# Altium schematic sheet EVK-IRIS-W1-TOP SHEET.SchDoc
size A3; DocumentNumber: 1; SheetNumber: 1; SheetTotal: 14
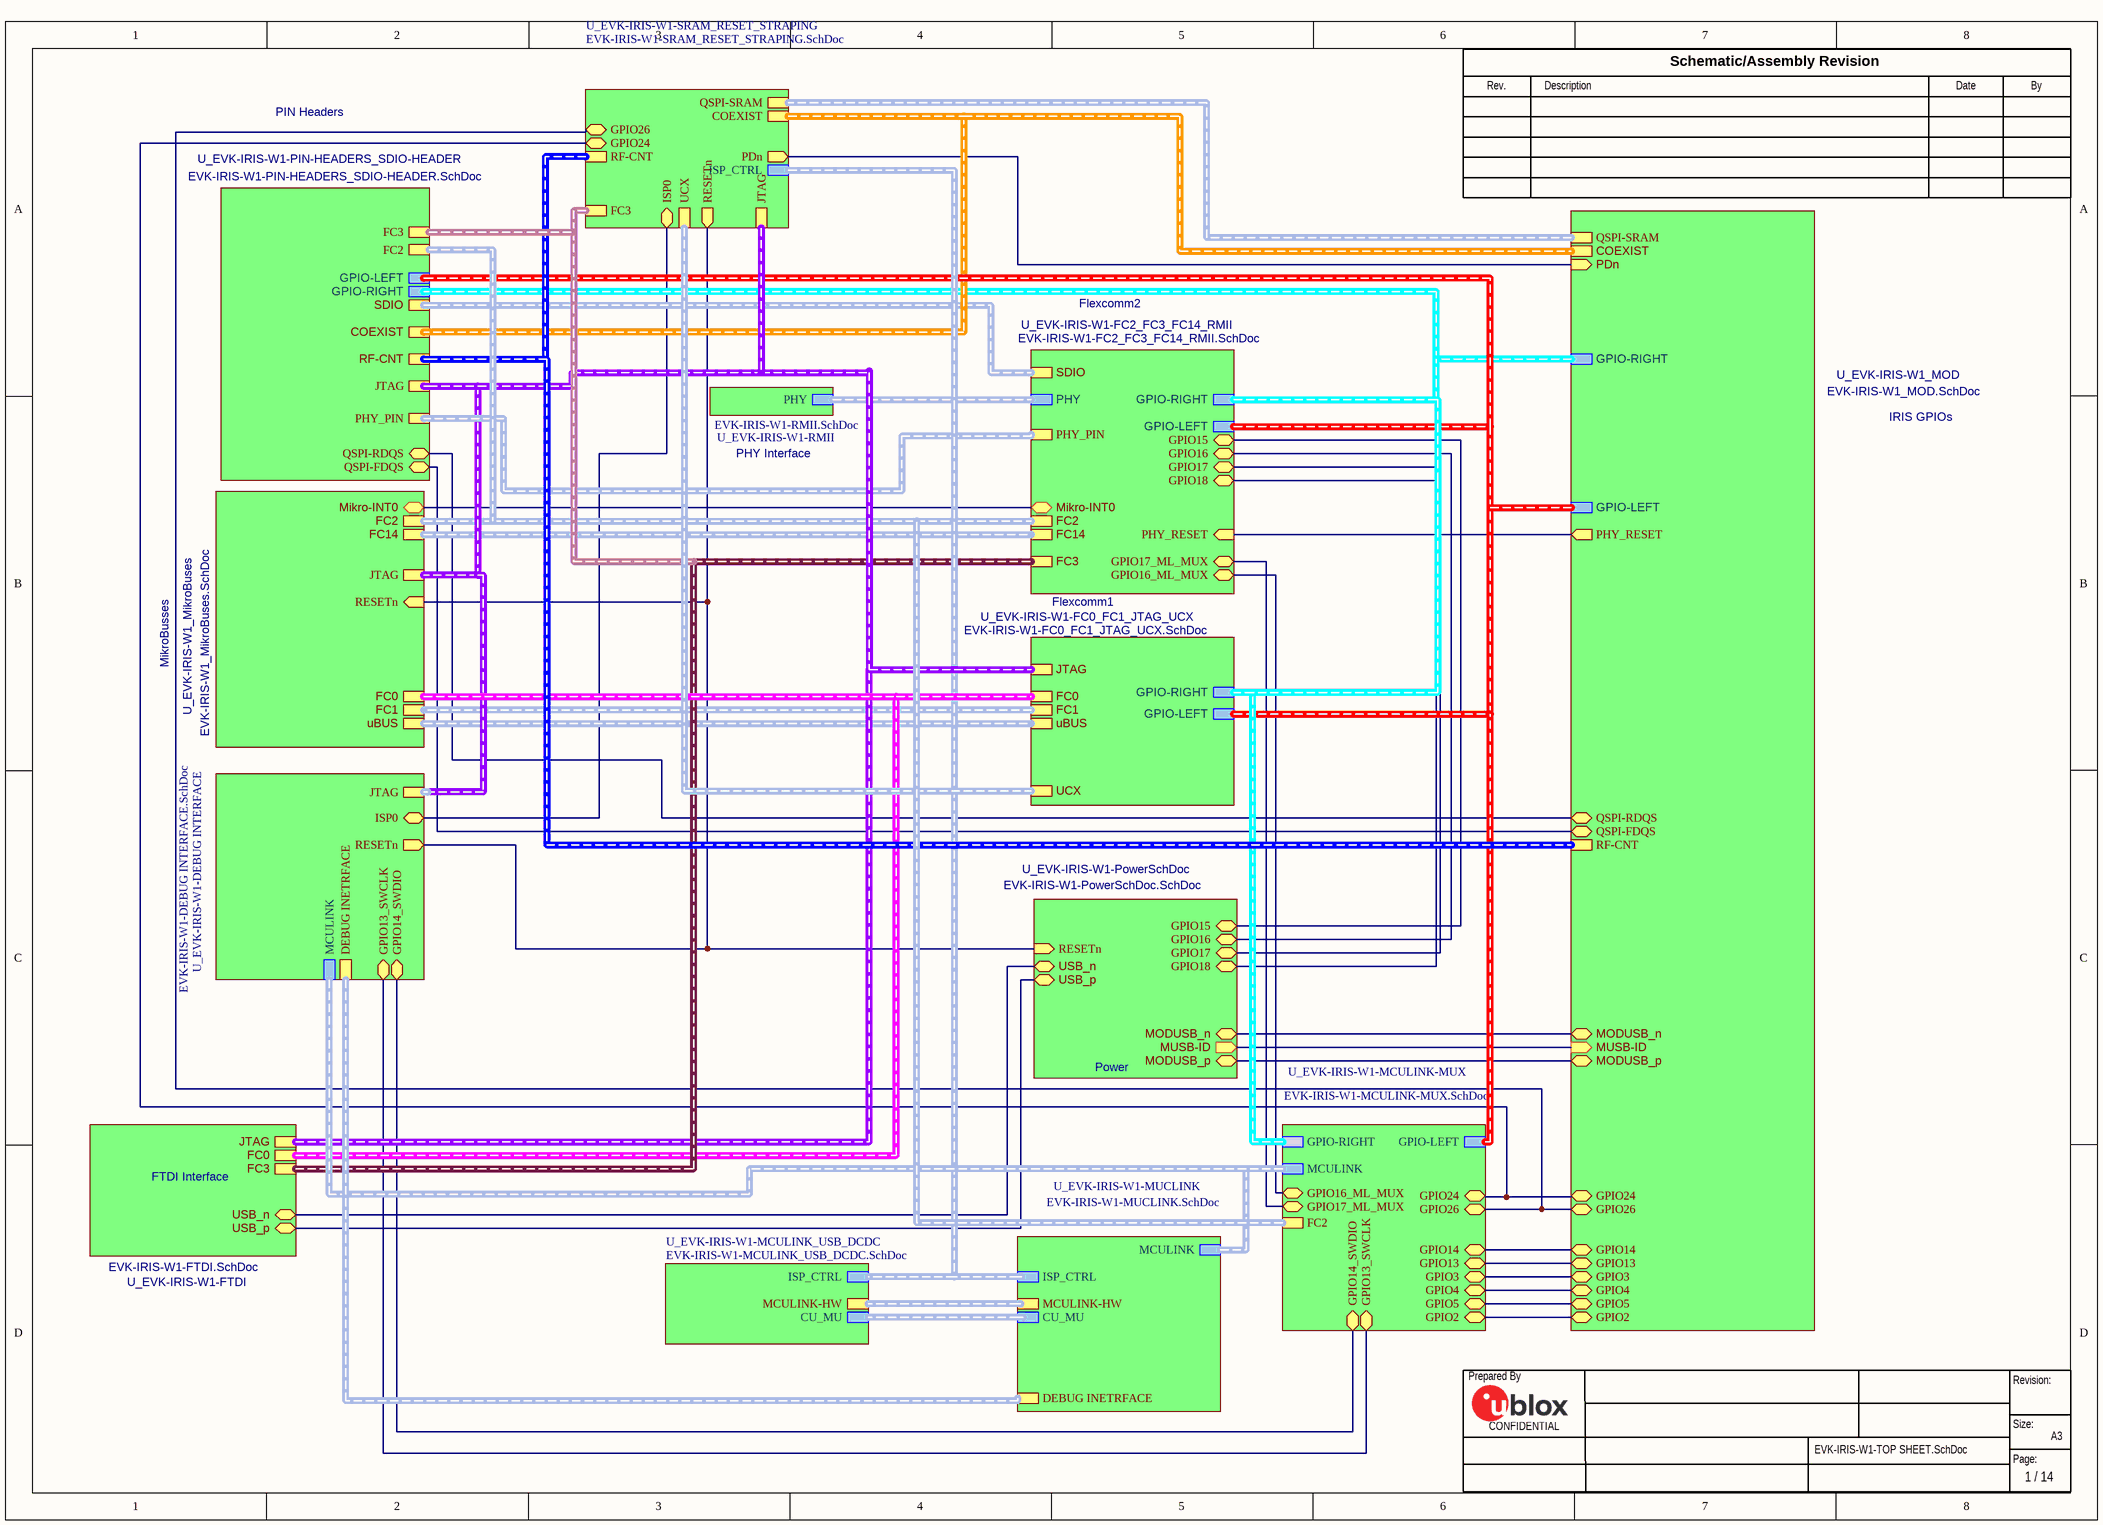
[diagram p0: EVK-IRIS-W1-TOP SHEET.SchDoc]

## Sub-sheets
U_EVK-IRIS-W1-DEBUG INTERFACE = EVK-IRIS-W1-DEBUG INTERFACE.SchDoc: JTAG (harness JTAG), GPIO13_SWCLK (bidir), GPIO14_SWDIO (bidir), DEBUG INETRFACE (harness DEBUG-INTERFACE), ISP0 (bidir), MCULINK (harness MCULINK), RESETn (out)
U_EVK-IRIS-W1-FC0_FC1_JTAG_UCX = EVK-IRIS-W1-FC0_FC1_JTAG_UCX.SchDoc: GPIO-RIGHT (harness GPIO-RIGHT), FC1 (harness FC1), JTAG (harness JTAG), FC0 (harness FC0), UCX (harness UCX), GPIO-LEFT (harness GPIO-LEFT), uBUS (harness uBUS)
U_EVK-IRIS-W1-FC2_FC3_FC14_RMII = EVK-IRIS-W1-FC2_FC3_FC14_RMII.SchDoc: GPIO-RIGHT (harness GPIO-RIGHT), PHY (harness PHY_HARNESS), FC14 (harness FC14), SDIO (harness SDIO), FC2 (harness FC2), FC3 (harness FC3), Mikro-INT0 (bidir), GPIO-LEFT (harness GPIO-LEFT), PHY_PIN (harness PHY_PIN HEADERS), PHY_RESET (in), GPIO15 (bidir), GPIO16 (bidir), GPIO17 (bidir), GPIO18 (bidir), GPIO16_ML_MUX (bidir), GPIO17_ML_MUX (bidir)
U_EVK-IRIS-W1-FTDI = EVK-IRIS-W1-FTDI.SchDoc: USB_n (bidir), USB_p (bidir), JTAG (harness JTAG), FC0 (harness FC0), FC3 (harness FC3)
U_EVK-IRIS-W1-MCULINK-MUX = EVK-IRIS-W1-MCULINK-MUX.SchDoc: GPIO-LEFT (harness GPIO-LEFT), GPIO-RIGHT (harness GPIO-RIGHT), GPIO24 (bidir), GPIO26 (bidir), GPIO14 (bidir), GPIO13 (bidir), GPIO3 (bidir), GPIO4 (bidir), GPIO5 (bidir), GPIO2 (bidir), MCULINK (harness MCULINK), GPIO14_SWDIO (bidir), GPIO13_SWCLK (bidir), GPIO16_ML_MUX (bidir), GPIO17_ML_MUX (bidir), FC2 (harness FC2)
U_EVK-IRIS-W1-MCULINK_USB_DCDC = EVK-IRIS-W1-MCULINK_USB_DCDC.SchDoc: MCULINK-HW (harness MCULINK_HW), CU_MU (harness CU_MU), ISP_CTRL (harness ISP_CTRL)
U_EVK-IRIS-W1-MUCLINK = EVK-IRIS-W1-MUCLINK.SchDoc: MCULINK-HW (harness MCULINK_HW), MCULINK (harness MCULINK), DEBUG INETRFACE (harness DEBUG-INTERFACE), CU_MU (harness CU_MU), ISP_CTRL (harness ISP_CTRL)
U_EVK-IRIS-W1-PIN-HEADERS_SDIO-HEADER = EVK-IRIS-W1-PIN-HEADERS_SDIO-HEADER.SchDoc: GPIO-RIGHT (harness GPIO-RIGHT), RF-CNT (harness RF-CNT), SDIO (harness SDIO), GPIO-LEFT (harness GPIO-LEFT), COEXIST (harness COEXIST), JTAG (harness JTAG), PHY_PIN (harness PHY_PIN HEADERS), QSPI-FDQS (bidir), QSPI-RDQS (bidir), FC2 (harness FC2), FC3 (harness FC3)
U_EVK-IRIS-W1-PowerSchDoc = EVK-IRIS-W1-PowerSchDoc.SchDoc: MODUSB_p (bidir), MODUSB_n (bidir), USB_n (bidir), USB_p (bidir), MUSB-ID (out), RESETn (in), GPIO16 (bidir), GPIO17 (bidir), GPIO18 (bidir), GPIO15 (bidir)
U_EVK-IRIS-W1-RMII = EVK-IRIS-W1-RMII.SchDoc: PHY (harness PHY_HARNESS)
U_EVK-IRIS-W1-SRAM_RESET_STRAPING = EVK-IRIS-W1-SRAM_RESET_STRAPING.SchDoc: PDn (out), QSPI-SRAM (harness QSPI-SRAM), RF-CNT (harness RF-CNT), COEXIST (harness COEXIST), ISP_CTRL (harness ISP_CTRL), ISP0 (bidir), GPIO24 (bidir), GPIO26 (bidir), UCX (harness UCX), FC3 (harness FC3), RESETn (out), JTAG (harness JTAG)
U_EVK-IRIS-W1_MikroBuses = EVK-IRIS-W1_MikroBuses.SchDoc: FC0 (harness FC0), Mikro-INT0 (bidir), FC14 (harness FC14), FC1 (harness FC1), FC2 (harness FC2), uBUS (harness uBUS), JTAG (harness JTAG), RESETn (in)
U_EVK-IRIS-W1_MOD = EVK-IRIS-W1_MOD.SchDoc: COEXIST (harness COEXIST), MODUSB_p (bidir), MODUSB_n (bidir), GPIO-RIGHT (harness GPIO-RIGHT), GPIO-LEFT (harness GPIO-LEFT), PDn (in), MUSB-ID (in), PHY_RESET (out), GPIO24 (bidir), GPIO26 (bidir), GPIO14 (bidir), GPIO13 (bidir), GPIO2 (bidir), GPIO3 (bidir), GPIO4 (bidir), GPIO5 (bidir), RF-CNT (harness RF-CNT), QSPI-RDQS (bidir), QSPI-SRAM (harness QSPI-SRAM), QSPI-FDQS (bidir)

## Nets
(unnamed): sheet U_EVK-IRIS-W1-FC2_FC3_FC14_RMII/Mikro-INT0, sheet U_EVK-IRIS-W1_MikroBuses/Mikro-INT0
(unnamed): sheet U_EVK-IRIS-W1-FC2_FC3_FC14_RMII/PHY_RESET, sheet U_EVK-IRIS-W1_MOD/PHY_RESET
(unnamed): sheet U_EVK-IRIS-W1-FC2_FC3_FC14_RMII/GPIO15, sheet U_EVK-IRIS-W1-PowerSchDoc/GPIO15
(unnamed): sheet U_EVK-IRIS-W1-FC2_FC3_FC14_RMII/GPIO16, sheet U_EVK-IRIS-W1-PowerSchDoc/GPIO16
(unnamed): sheet U_EVK-IRIS-W1-FC2_FC3_FC14_RMII/GPIO17, sheet U_EVK-IRIS-W1-PowerSchDoc/GPIO17
(unnamed): sheet U_EVK-IRIS-W1-FC2_FC3_FC14_RMII/GPIO18, sheet U_EVK-IRIS-W1-PowerSchDoc/GPIO18
(unnamed): sheet U_EVK-IRIS-W1-FC2_FC3_FC14_RMII/GPIO16_ML_MUX, sheet U_EVK-IRIS-W1-MCULINK-MUX/GPIO16_ML_MUX
(unnamed): sheet U_EVK-IRIS-W1-FC2_FC3_FC14_RMII/GPIO17_ML_MUX, sheet U_EVK-IRIS-W1-MCULINK-MUX/GPIO17_ML_MUX
(unnamed): sheet U_EVK-IRIS-W1-FTDI/USB_n, sheet U_EVK-IRIS-W1-PowerSchDoc/USB_n
(unnamed): sheet U_EVK-IRIS-W1-FTDI/USB_p, sheet U_EVK-IRIS-W1-PowerSchDoc/USB_p
(unnamed): sheet U_EVK-IRIS-W1-PIN-HEADERS_SDIO-HEADER/QSPI-FDQS, sheet U_EVK-IRIS-W1_MOD/QSPI-FDQS
(unnamed): sheet U_EVK-IRIS-W1-PIN-HEADERS_SDIO-HEADER/QSPI-RDQS, sheet U_EVK-IRIS-W1_MOD/QSPI-RDQS
(unnamed): sheet U_EVK-IRIS-W1-PowerSchDoc/MODUSB_p, sheet U_EVK-IRIS-W1_MOD/MODUSB_p
(unnamed): sheet U_EVK-IRIS-W1-PowerSchDoc/MODUSB_n, sheet U_EVK-IRIS-W1_MOD/MODUSB_n
(unnamed): sheet U_EVK-IRIS-W1-PowerSchDoc/MUSB-ID, sheet U_EVK-IRIS-W1_MOD/MUSB-ID
(unnamed): sheet U_EVK-IRIS-W1-PowerSchDoc/RESETn, sheet U_EVK-IRIS-W1_MikroBuses/RESETn, sheet U_EVK-IRIS-W1-DEBUG INTERFACE/RESETn, sheet U_EVK-IRIS-W1-SRAM_RESET_STRAPING/RESETn
(unnamed): sheet U_EVK-IRIS-W1_MOD/PDn, sheet U_EVK-IRIS-W1-SRAM_RESET_STRAPING/PDn
(unnamed): sheet U_EVK-IRIS-W1_MOD/GPIO24, sheet U_EVK-IRIS-W1-MCULINK-MUX/GPIO24, sheet U_EVK-IRIS-W1-SRAM_RESET_STRAPING/GPIO24
(unnamed): sheet U_EVK-IRIS-W1_MOD/GPIO26, sheet U_EVK-IRIS-W1-MCULINK-MUX/GPIO26, sheet U_EVK-IRIS-W1-SRAM_RESET_STRAPING/GPIO26
(unnamed): sheet U_EVK-IRIS-W1_MOD/GPIO14, sheet U_EVK-IRIS-W1-MCULINK-MUX/GPIO14
(unnamed): sheet U_EVK-IRIS-W1_MOD/GPIO13, sheet U_EVK-IRIS-W1-MCULINK-MUX/GPIO13
(unnamed): sheet U_EVK-IRIS-W1_MOD/GPIO2, sheet U_EVK-IRIS-W1-MCULINK-MUX/GPIO2
(unnamed): sheet U_EVK-IRIS-W1_MOD/GPIO3, sheet U_EVK-IRIS-W1-MCULINK-MUX/GPIO3
(unnamed): sheet U_EVK-IRIS-W1_MOD/GPIO4, sheet U_EVK-IRIS-W1-MCULINK-MUX/GPIO4
(unnamed): sheet U_EVK-IRIS-W1_MOD/GPIO5, sheet U_EVK-IRIS-W1-MCULINK-MUX/GPIO5
(unnamed): sheet U_EVK-IRIS-W1-MCULINK-MUX/GPIO14_SWDIO, sheet U_EVK-IRIS-W1-DEBUG INTERFACE/GPIO14_SWDIO
(unnamed): sheet U_EVK-IRIS-W1-MCULINK-MUX/GPIO13_SWCLK, sheet U_EVK-IRIS-W1-DEBUG INTERFACE/GPIO13_SWCLK
(unnamed): sheet U_EVK-IRIS-W1-DEBUG INTERFACE/ISP0, sheet U_EVK-IRIS-W1-SRAM_RESET_STRAPING/ISP0

## Buses and harness runs
harness sheet U_EVK-IRIS-W1-DEBUG INTERFACE/DEBUG INETRFACE = sheet U_EVK-IRIS-W1-MUCLINK/DEBUG INETRFACE
harness sheet U_EVK-IRIS-W1-DEBUG INTERFACE/JTAG = sheet U_EVK-IRIS-W1-FC0_FC1_JTAG_UCX/JTAG = sheet U_EVK-IRIS-W1-FTDI/JTAG = sheet U_EVK-IRIS-W1-PIN-HEADERS_SDIO-HEADER/JTAG = sheet U_EVK-IRIS-W1-SRAM_RESET_STRAPING/JTAG = sheet U_EVK-IRIS-W1_MikroBuses/JTAG
harness sheet U_EVK-IRIS-W1-DEBUG INTERFACE/MCULINK = sheet U_EVK-IRIS-W1-MCULINK-MUX/MCULINK = sheet U_EVK-IRIS-W1-MUCLINK/MCULINK
harness sheet U_EVK-IRIS-W1-FC0_FC1_JTAG_UCX/FC0 = sheet U_EVK-IRIS-W1-FTDI/FC0 = sheet U_EVK-IRIS-W1_MikroBuses/FC0
harness sheet U_EVK-IRIS-W1-FC0_FC1_JTAG_UCX/FC1 = sheet U_EVK-IRIS-W1_MikroBuses/FC1
harness sheet U_EVK-IRIS-W1-FC0_FC1_JTAG_UCX/GPIO-LEFT = sheet U_EVK-IRIS-W1-FC2_FC3_FC14_RMII/GPIO-LEFT = sheet U_EVK-IRIS-W1-MCULINK-MUX/GPIO-LEFT = sheet U_EVK-IRIS-W1-PIN-HEADERS_SDIO-HEADER/GPIO-LEFT = sheet U_EVK-IRIS-W1_MOD/GPIO-LEFT
harness sheet U_EVK-IRIS-W1-FC0_FC1_JTAG_UCX/GPIO-RIGHT = sheet U_EVK-IRIS-W1-FC2_FC3_FC14_RMII/GPIO-RIGHT = sheet U_EVK-IRIS-W1-MCULINK-MUX/GPIO-RIGHT = sheet U_EVK-IRIS-W1-PIN-HEADERS_SDIO-HEADER/GPIO-RIGHT = sheet U_EVK-IRIS-W1_MOD/GPIO-RIGHT
harness sheet U_EVK-IRIS-W1-FC0_FC1_JTAG_UCX/uBUS = sheet U_EVK-IRIS-W1_MikroBuses/uBUS
harness sheet U_EVK-IRIS-W1-FC0_FC1_JTAG_UCX/UCX = sheet U_EVK-IRIS-W1-SRAM_RESET_STRAPING/UCX
harness sheet U_EVK-IRIS-W1-FC2_FC3_FC14_RMII/FC2 = sheet U_EVK-IRIS-W1-MCULINK-MUX/FC2 = sheet U_EVK-IRIS-W1-PIN-HEADERS_SDIO-HEADER/FC2 = sheet U_EVK-IRIS-W1_MikroBuses/FC2
harness sheet U_EVK-IRIS-W1-FC2_FC3_FC14_RMII/FC3 = sheet U_EVK-IRIS-W1-FTDI/FC3 = sheet U_EVK-IRIS-W1-PIN-HEADERS_SDIO-HEADER/FC3 = sheet U_EVK-IRIS-W1-SRAM_RESET_STRAPING/FC3
harness sheet U_EVK-IRIS-W1-FC2_FC3_FC14_RMII/FC14 = sheet U_EVK-IRIS-W1_MikroBuses/FC14
harness sheet U_EVK-IRIS-W1-FC2_FC3_FC14_RMII/PHY = sheet U_EVK-IRIS-W1-RMII/PHY
harness sheet U_EVK-IRIS-W1-FC2_FC3_FC14_RMII/PHY_PIN = sheet U_EVK-IRIS-W1-PIN-HEADERS_SDIO-HEADER/PHY_PIN
harness sheet U_EVK-IRIS-W1-FC2_FC3_FC14_RMII/SDIO = sheet U_EVK-IRIS-W1-PIN-HEADERS_SDIO-HEADER/SDIO
harness sheet U_EVK-IRIS-W1-MCULINK_USB_DCDC/CU_MU = sheet U_EVK-IRIS-W1-MUCLINK/CU_MU
harness sheet U_EVK-IRIS-W1-MCULINK_USB_DCDC/ISP_CTRL = sheet U_EVK-IRIS-W1-MUCLINK/ISP_CTRL = sheet U_EVK-IRIS-W1-SRAM_RESET_STRAPING/ISP_CTRL
harness sheet U_EVK-IRIS-W1-MCULINK_USB_DCDC/MCULINK-HW = sheet U_EVK-IRIS-W1-MUCLINK/MCULINK-HW
harness sheet U_EVK-IRIS-W1-PIN-HEADERS_SDIO-HEADER/COEXIST = sheet U_EVK-IRIS-W1-SRAM_RESET_STRAPING/COEXIST = sheet U_EVK-IRIS-W1_MOD/COEXIST
harness sheet U_EVK-IRIS-W1-PIN-HEADERS_SDIO-HEADER/RF-CNT = sheet U_EVK-IRIS-W1-SRAM_RESET_STRAPING/RF-CNT = sheet U_EVK-IRIS-W1_MOD/RF-CNT
harness sheet U_EVK-IRIS-W1-SRAM_RESET_STRAPING/QSPI-SRAM = sheet U_EVK-IRIS-W1_MOD/QSPI-SRAM

## Notes on the sheet
- PIN Headers
- Flexcomm2
- PHY Interface
- IRIS GPIOs
- MikroBusses
- Flexcomm1
- Power
- FTDI Interface
- Rev.
- Description
- Schematic/Assembly Revision
- Date
- By
- Prepared By
- Revision:
- CONFIDENTIAL
- Page:
- Size:
- A3